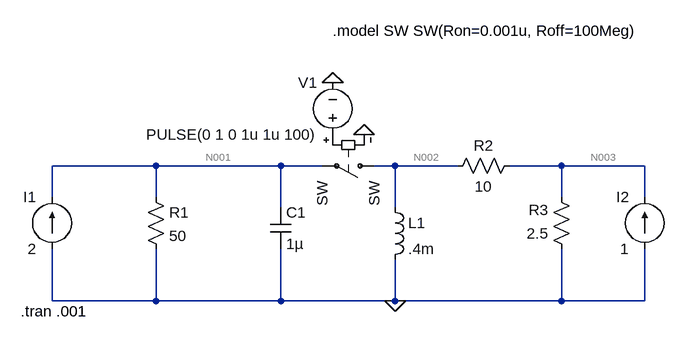
[diagram p0: schematic pas72.asc]
pas72.asc, the LTspice schematic file:
Version 4.1
SHEET 1 996 680
WIRE 208 64 48 64
WIRE 400 64 208 64
WIRE 464 64 400 64
WIRE 576 64 544 64
WIRE 672 64 576 64
WIRE 832 64 752 64
WIRE 960 64 832 64
WIRE 48 112 48 64
WIRE 208 112 208 64
WIRE 832 112 832 64
WIRE 960 112 960 64
WIRE 400 128 400 64
WIRE 576 128 576 64
WIRE 48 272 48 192
WIRE 208 272 208 192
WIRE 208 272 48 272
WIRE 400 272 400 192
WIRE 400 272 208 272
WIRE 576 272 576 208
WIRE 576 272 400 272
WIRE 832 272 832 192
WIRE 832 272 576 272
WIRE 960 272 960 192
WIRE 960 272 832 272
FLAG 480 -64 0
FLAG 528 16 0
FLAG 576 272 0
SYMBOL current 48 192 R180
WINDOW 0 24 80 Left 2
WINDOW 3 24 0 Left 2
WINDOW 123 0 0 Left 0
WINDOW 39 0 0 Left 0
SYMATTR InstName I1
SYMATTR Value 2
SYMBOL res 192 96 R0
SYMATTR InstName R1
SYMATTR Value 50
SYMBOL cap 384 128 R0
SYMATTR InstName C1
SYMATTR Value 1µ
SYMBOL ind 560 112 R0
SYMATTR InstName L1
SYMATTR Value .4m
SYMBOL res 768 48 R90
WINDOW 0 0 56 VBottom 2
WINDOW 3 32 56 VTop 2
SYMATTR InstName R2
SYMATTR Value 10
SYMBOL res 848 208 R180
WINDOW 0 36 76 Left 2
WINDOW 3 36 40 Left 2
SYMATTR InstName R3
SYMATTR Value 2.5
SYMBOL current 960 192 R180
WINDOW 0 24 80 Left 2
WINDOW 3 24 0 Left 2
SYMATTR InstName I2
SYMATTR Value 1
SYMBOL sw 560 64 R90
SYMATTR InstName SW
SYMBOL voltage 480 32 R180
WINDOW 0 24 96 Left 2
WINDOW 3 24 16 Left 2
WINDOW 123 0 0 Left 0
WINDOW 39 0 0 Left 0
SYMATTR InstName V1
SYMATTR Value PULSE(0 1 0 1u 1u 100)
TEXT 480 -144 Left 2 !.model SW SW(Ron=0.001u, Roff=100Meg)
TEXT 0 288 Left 2 !.tran .001

The netlist it stands for:
* pas72.asc
I1 0 N001 2
R1 N001 0 50
C1 N001 0 1µ
L1 N002 0 .4m
R2 N003 N002 10
R3 0 N003 2.5
I2 0 N003 1
SW N002 N001 P001 0 SW
V1 P001 0 PULSE(0 1 0 1u 1u 100)
.model SW SW(Ron=0.001u, Roff=100Meg)
.tran .001
.backanno
.end

* Results of the author's LTspice run, read from the files saved beside the schematic
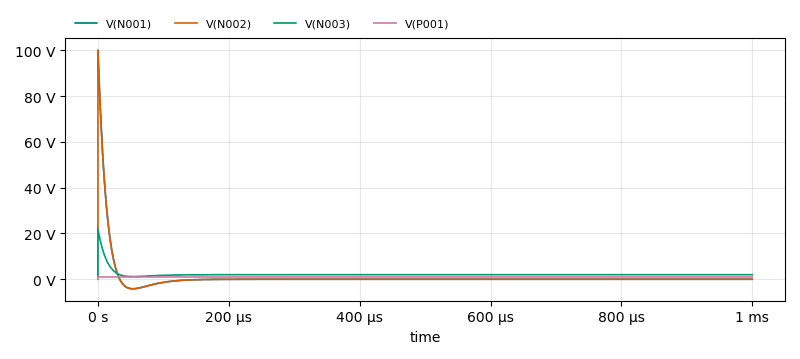
[diagram p1: Transient Analysis of pas72.asc, plotted from the saved traces]
* Transient Analysis, 1 run:
*   V(N001): min -4.171 V, max 100 V, average 802.8 mV, rms 7.644 V, last 2.2 mV
*   V(N002): min -4.171 V, max 100 V, average 802.8 mV, rms 7.644 V, last 2.2 mV
*   V(N003): min 1.166 V, max 22 V, average 2.161 V, rms 2.642 V, last 2 V
*   V(P001): min 0 V, max 1 V, average 999.5 mV, rms 999.7 mV, last 1 V